# EAGLE design bottom PCB (EAGLE 7.2.0)
CNAME: SHF ROBOTICS; CREVISION: 2; DESIGNER: TOM HULBERT
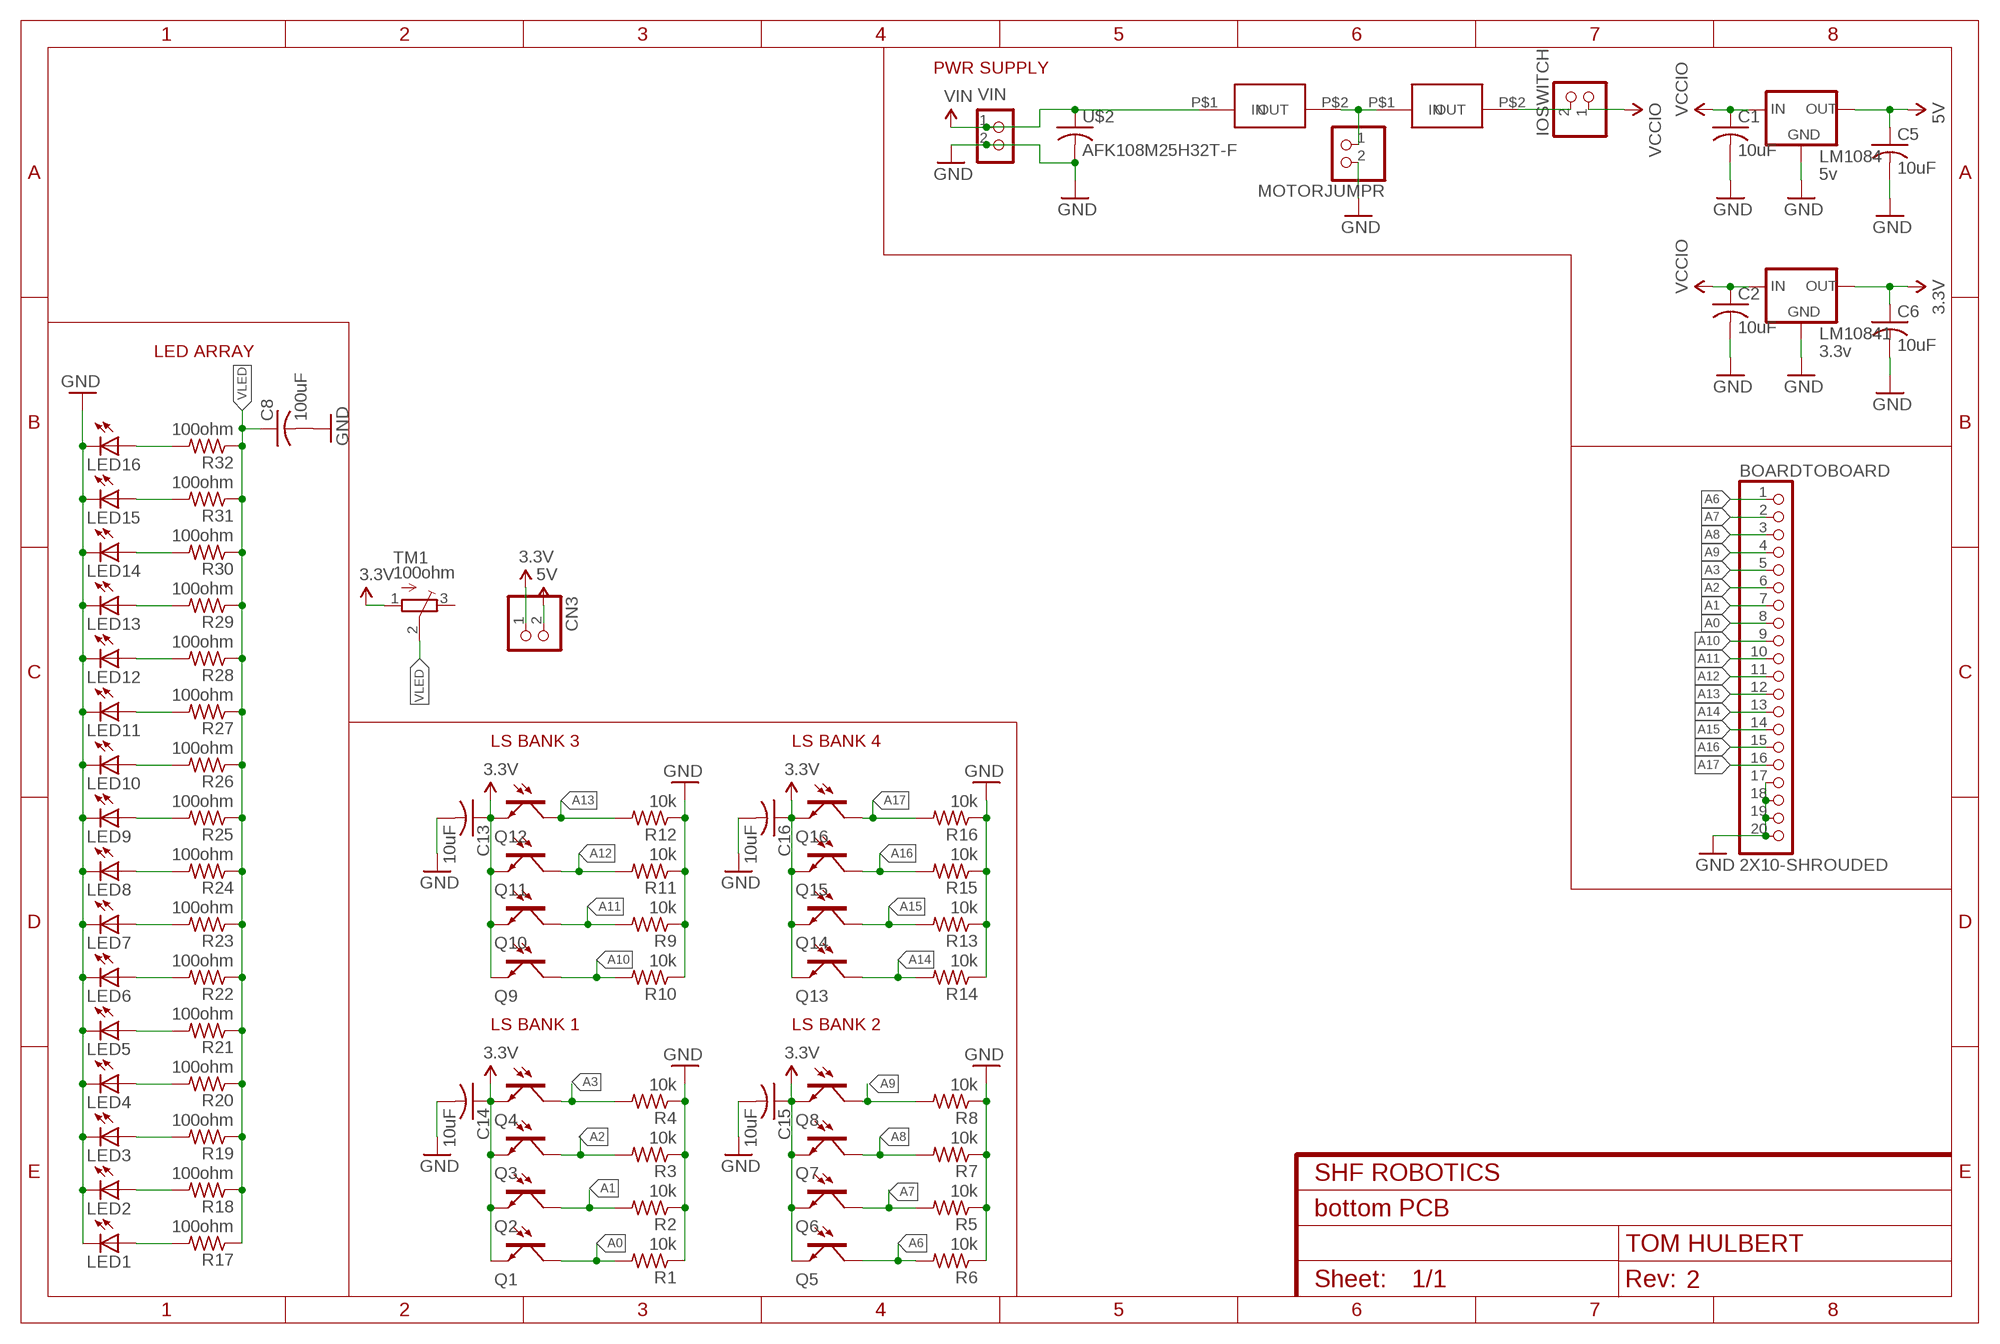
[diagram p0: schematic, sheet 1]

## Parts
2A  0153007_FUSE  [0153007_]
5A  5a  0153007_FUSE  [0153007_]
BOARDTOBOARD  2X10-SHROUDED  [2X10-SHROUDED]
C1  10uF  C-USC0805  [C0805]
C2  10uF  C-USC0805  [C0805]
C5  10uF  C-USC0805  [C0805]
C6  10uF  C-USC0805  [C0805]
C8  100uF  C-USC0805  [C0805]
C13  10uF  C-USC0805  [C0805]
C14  10uF  C-USC0805  [C0805]
C15  10uF  C-USC0805  [C0805]
C16  10uF  C-USC0805  [C0805]
CN3  JST_2PIN-SMT  [JST-PH-2-SMT]
IOSWITCH  JST_2PIN-SMT  [JST-PH-2-SMT]
LED1  LEDCHIPLED_0805  [CHIPLED_0805]
LED2  LEDCHIPLED_0805  [CHIPLED_0805]
LED3  LEDCHIPLED_0805  [CHIPLED_0805]
LED4  LEDCHIPLED_0805  [CHIPLED_0805]
LED5  LEDCHIPLED_0805  [CHIPLED_0805]
LED6  LEDCHIPLED_0805  [CHIPLED_0805]
LED7  LEDCHIPLED_0805  [CHIPLED_0805]
LED8  LEDCHIPLED_0805  [CHIPLED_0805]
LED9  LEDCHIPLED_0805  [CHIPLED_0805]
LED10  LEDCHIPLED_0805  [CHIPLED_0805]
LED11  LEDCHIPLED_0805  [CHIPLED_0805]
LED12  LEDCHIPLED_0805  [CHIPLED_0805]
LED13  LEDCHIPLED_0805  [CHIPLED_0805]
LED14  LEDCHIPLED_0805  [CHIPLED_0805]
LED15  LEDCHIPLED_0805  [CHIPLED_0805]
LED16  LEDCHIPLED_0805  [CHIPLED_0805]
LM1084  5v  LD29150  [D2PACK]
LM10841  3.3v  LD29150  [D2PACK]
MOTORJUMPR  JST_2PIN-SMT  [JST-PH-2-SMT]
Q1  PHOTOTRANSISTORCHIPLED_1206  [CHIPLED_1206]
Q2  PHOTOTRANSISTORCHIPLED_1206  [CHIPLED_1206]
Q3  PHOTOTRANSISTORCHIPLED_1206  [CHIPLED_1206]
Q4  PHOTOTRANSISTORCHIPLED_1206  [CHIPLED_1206]
Q5  PHOTOTRANSISTORCHIPLED_1206  [CHIPLED_1206]
Q6  PHOTOTRANSISTORCHIPLED_1206  [CHIPLED_1206]
Q7  PHOTOTRANSISTORCHIPLED_1206  [CHIPLED_1206]
Q8  PHOTOTRANSISTORCHIPLED_1206  [CHIPLED_1206]
Q9  PHOTOTRANSISTORCHIPLED_1206  [CHIPLED_1206]
Q10  PHOTOTRANSISTORCHIPLED_1206  [CHIPLED_1206]
Q11  PHOTOTRANSISTORCHIPLED_1206  [CHIPLED_1206]
Q12  PHOTOTRANSISTORCHIPLED_1206  [CHIPLED_1206]
Q13  PHOTOTRANSISTORCHIPLED_1206  [CHIPLED_1206]
Q14  PHOTOTRANSISTORCHIPLED_1206  [CHIPLED_1206]
Q15  PHOTOTRANSISTORCHIPLED_1206  [CHIPLED_1206]
Q16  PHOTOTRANSISTORCHIPLED_1206  [CHIPLED_1206]
R1  10k  R-US_M0805  [M0805]
R2  10k  R-US_M0805  [M0805]
R3  10k  R-US_M0805  [M0805]
R4  10k  R-US_M0805  [M0805]
R5  10k  R-US_M0805  [M0805]
R6  10k  R-US_M0805  [M0805]
R7  10k  R-US_M0805  [M0805]
R8  10k  R-US_M0805  [M0805]
R9  10k  R-US_M0805  [M0805]
R10  10k  R-US_M0805  [M0805]
R11  10k  R-US_M0805  [M0805]
R12  10k  R-US_M0805  [M0805]
R13  10k  R-US_M0805  [M0805]
R14  10k  R-US_M0805  [M0805]
R15  10k  R-US_M0805  [M0805]
R16  10k  R-US_M0805  [M0805]
R17  100ohm  R-US_M0805  [M0805]
R18  100ohm  R-US_M0805  [M0805]
R19  100ohm  R-US_M0805  [M0805]
R20  100ohm  R-US_M0805  [M0805]
R21  100ohm  R-US_M0805  [M0805]
R22  100ohm  R-US_M0805  [M0805]
R23  100ohm  R-US_M0805  [M0805]
R24  100ohm  R-US_M0805  [M0805]
R25  100ohm  R-US_M0805  [M0805]
R26  100ohm  R-US_M0805  [M0805]
R27  100ohm  R-US_M0805  [M0805]
R28  100ohm  R-US_M0805  [M0805]
R29  100ohm  R-US_M0805  [M0805]
R30  100ohm  R-US_M0805  [M0805]
R31  100ohm  R-US_M0805  [M0805]
R32  100ohm  R-US_M0805  [M0805]
TM1  100ohm  TRIMPOTTC33X  [TC33X]
U$2  AFK108M25H32T-F  [AFK108M25H32T-F]
VIN  CON_TERMINAL_BLOCK_02-5MM  [TERMINAL_BLOCK_2P_5]

## Nets
3.3V: C6.1 C13.1 C14.1 C15.1 C16.1 CN3.1 LM10841.2(VOUT) Q1.C Q2.C Q3.C Q4.C Q5.C Q6.C Q7.C Q8.C Q9.C Q10.C Q11.C Q12.C Q13.C Q14.C Q15.C Q16.C TM1.1(A)
5V: C5.1 CN3.2 LM1084.2(VOUT)
A0: BOARDTOBOARD.8 Q1.A R1.2
A1: BOARDTOBOARD.7 Q2.A R2.2
A2: BOARDTOBOARD.6 Q3.A R3.2
A3: BOARDTOBOARD.5 Q4.A R4.2
A6: BOARDTOBOARD.1 Q5.A R6.2
A7: BOARDTOBOARD.2 Q6.A R5.2
A8: BOARDTOBOARD.3 Q7.A R7.2
A9: BOARDTOBOARD.4 Q8.A R8.2
A10: BOARDTOBOARD.9 Q9.A R10.2
A11: BOARDTOBOARD.10 Q10.A R9.2
A12: BOARDTOBOARD.11 Q11.A R11.2
A13: BOARDTOBOARD.12 Q12.A R12.2
A14: BOARDTOBOARD.13 Q13.A R14.2
A15: BOARDTOBOARD.14 Q14.A R13.2
A16: BOARDTOBOARD.15 Q15.A R15.2
A17: BOARDTOBOARD.16 Q16.A R16.2
GND: BOARDTOBOARD.17 BOARDTOBOARD.18 BOARDTOBOARD.19 BOARDTOBOARD.20 C1.2 C2.2 C5.2 C6.2 C8.2 C13.2 C14.2 C15.2 C16.2 LED1.C LED2.C LED3.C LED4.C LED5.C LED6.C LED7.C LED8.C LED9.C LED10.C LED11.C LED12.C LED13.C LED14.C LED15.C LED16.C LM1084.1(GND) LM10841.1(GND) MOTORJUMPR.2 R1.1 R2.1 R3.1 R4.1 R5.1 R6.1 R7.1 R8.1 R9.1 R10.1 R11.1 R12.1 R13.1 R14.1 R15.1 R16.1 U$2.POS VIN.2
N$10: LED1.A R17.2
N$11: 2A.P$2(OUT) IOSWITCH.2
N$12: LED2.A R18.2
N$17: LED3.A R19.2
N$19: LED4.A R20.2
N$20: LED5.A R21.2
N$22: LED6.A R22.2
N$23: LED7.A R23.2
N$24: LED8.A R24.2
N$25: LED9.A R25.2
N$26: LED10.A R26.2
N$27: LED11.A R27.2
N$28: LED12.A R28.2
N$29: LED13.A R29.2
N$30: LED14.A R30.2
N$31: LED15.A R31.2
N$32: LED16.A R32.2
VCC: 2A.P$1(IN) 5A.P$2(OUT) MOTORJUMPR.1
VCCIO: C1.1 C2.1 IOSWITCH.1 LM1084.3(VIN) LM10841.3(VIN)
VIN: 5A.P$1(IN) U$2.NEG VIN.1
VLED: C8.1 R17.1 R18.1 R19.1 R20.1 R21.1 R22.1 R23.1 R24.1 R25.1 R26.1 R27.1 R28.1 R29.1 R30.1 R31.1 R32.1 TM1.2(S)
Unconnected: TM1.3(E)

## Notes on the sheet
- PWR SUPPLY
- LED ARRAY
- LS BANK 3 | LS BANK 4
- LS BANK 1 | LS BANK 2

## Library data of the parts
2A 5A = LittelFuse:0153007_
BOARDTOBOARD = 2x10 Shrouded Header:2X10-SHROUDED
C1 C2 C5 C6 C8 C13-C16 = adafruit:C-US: CAPACITOR, American symbol
CN3 IOSWITCH MOTORJUMPR = adafruit:JST_2PIN: JST 2-Pin Connectors of various flavors SMT-RA (S2B-PH-SM4) 4UConnector #17311 SMT (B2B-PH-SM4) THM-RA (S2B-PH) THM (B2B-PH)
LED1-LED16 = adafruit:LED: LED OSRAM: - CHIPLED LG R971, LG N971, LY N971, LG Q971, LY Q971, LO R971, LY R971 LH N974, LH R974 LS Q976, LO Q976, LY Q976 LO Q996 - Hyper CHIPLED LW Q18S LB Q993, LB Q99A, LB R99A - SideLED LS A670, LO A670, LY A670, LG A670, LP A670 LB A673, LV A673, LT A673, LW A673 LH A674 LY A675 LS A676, LA A676, LO A676, LY A676, LW A676 LS A679, LY A679, LG A679 - Hyper Micro SIDELED® LS Y876, LA Y876, LO Y876, LY Y876 LT Y87S - SmartLED LW L88C, LW L88S LB L89C, LB L89S, LG L890 LS L89K, LO L89K, LY L89K LS L896, LA L896, LO L896, LY L896 - TOPLED LS T670, LO T670, LY T670, LG T670, LP T670 LSG T670, LSP T670, LSY T670, LOP T670, LYG T670 LG T671, LOG T671, LSG T671 LB T673, LV T673, LT T673, LW T673 LH T674 LS T676, LA T676, LO T676, LY T676, LB T676, LH T676, LSB T676, LW T676 LB T67C, LV T67C, LT T67C, LS T67K, LO T67K, LY T67K, LW E67C LS E67B, LA E67B, LO E67B, LY E67B, LB E67C, LV E67C, LT E67C LW T67C LS T679, LY T679, LG T679 LS T770, LO T770, LY T770, LG T770, LP T770 LB T773, LV T773, LT T773, LW T773 LH T774 LS E675, LA E675, LY E675, LS T675 LS T776, LA T776, LO T776, LY T776, LB T776 LHGB T686 LT T68C, LB T68C - Hyper Mini TOPLED® LB M676 - Mini TOPLED Santana® LG M470 LS M47K, LO M47K, LY M47K Source: http://www.osram.convergy.de/
LM1084 LM10841 = bt_regulator:LD29150: STM LD29150 LDO Voltage Regulator The LD29150xx is a high current, high accuracy, low-dropout voltage regulator series. These regulators feature 400 mV dropout voltage and very low ground current. Designed for high current loads, these devices are also used in lower current, extremely low dropout-critical systems, where their tiny dropout voltage and ground current values are important attributes. Datasheet.pdf <http://www.st.com/web/en/resource/technical/document/datasheet/CD00003403.pdf>
Q1-Q16 = bt_opto:PHOTOTRANSISTOR: Phototransistor
R1-R32 = adafruit:R-US_: RESISTOR, American symbol
TM1 = adafruit:TRIMPOT: SMT trimmer potentiometer part number TC33X http://www.ladyada.net/library/eagle
U$2 = AFK108M25H32T-F Electrolytic Capacitor:AFK108M25H32T-F
VIN = dp_devices:CON_TERMINAL_BLOCK_02: 2 poles wire to board terminal block

## Module TEST
Ports: 

### Library data of the parts

## Module TSOP
Ports: 

### Library data of the parts

## Board
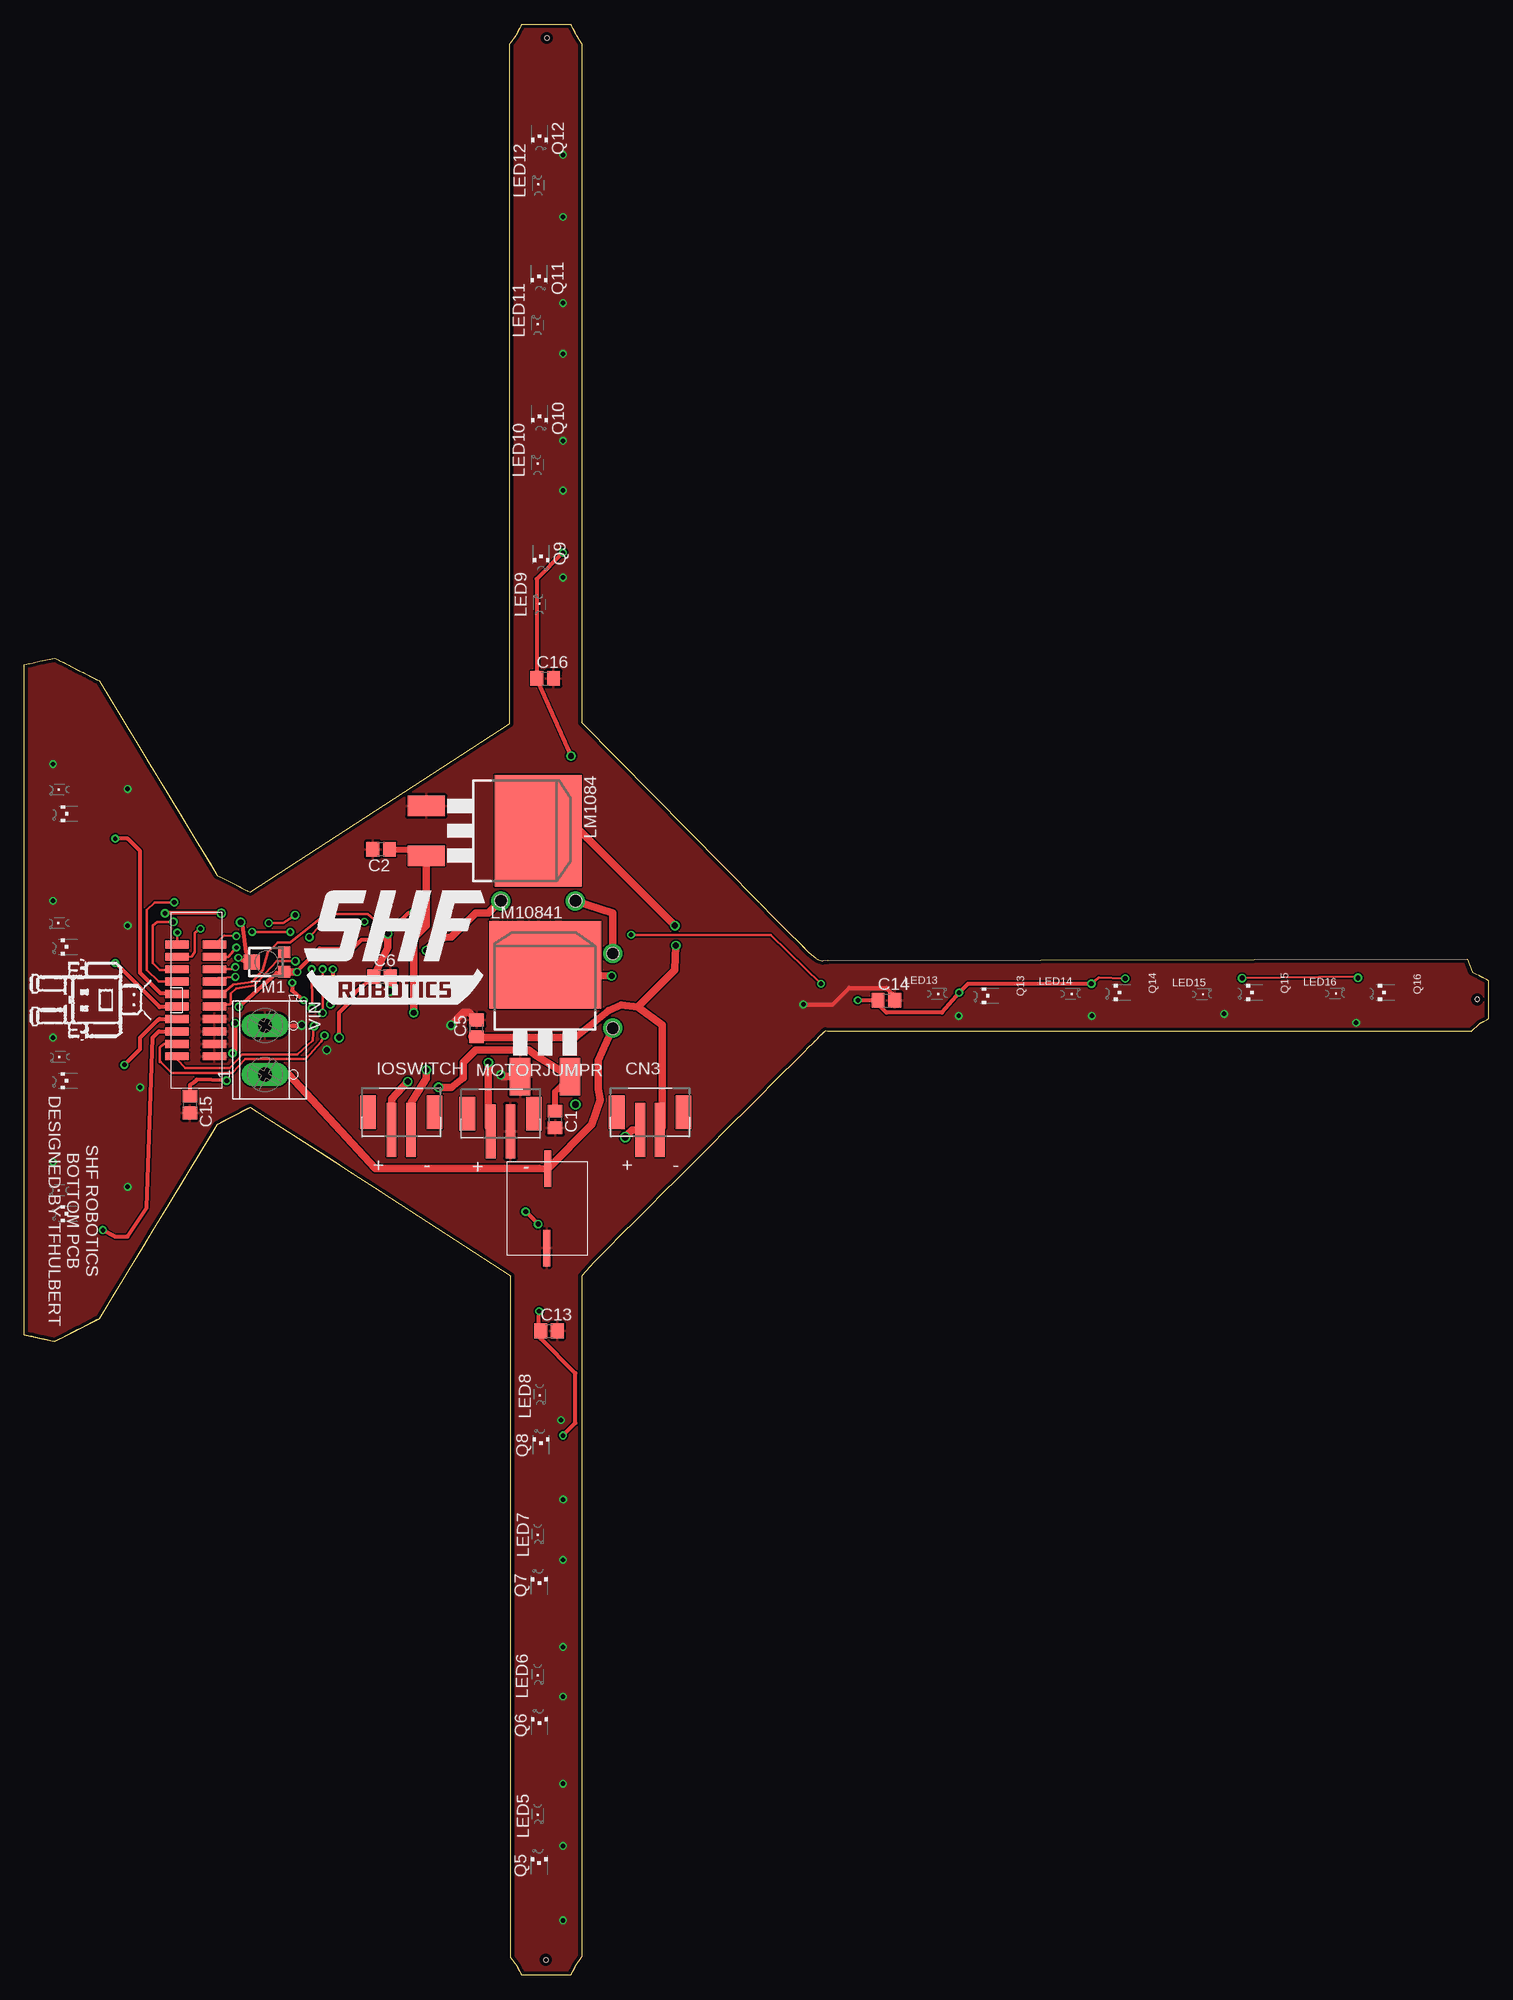
[diagram p1: board, top side]
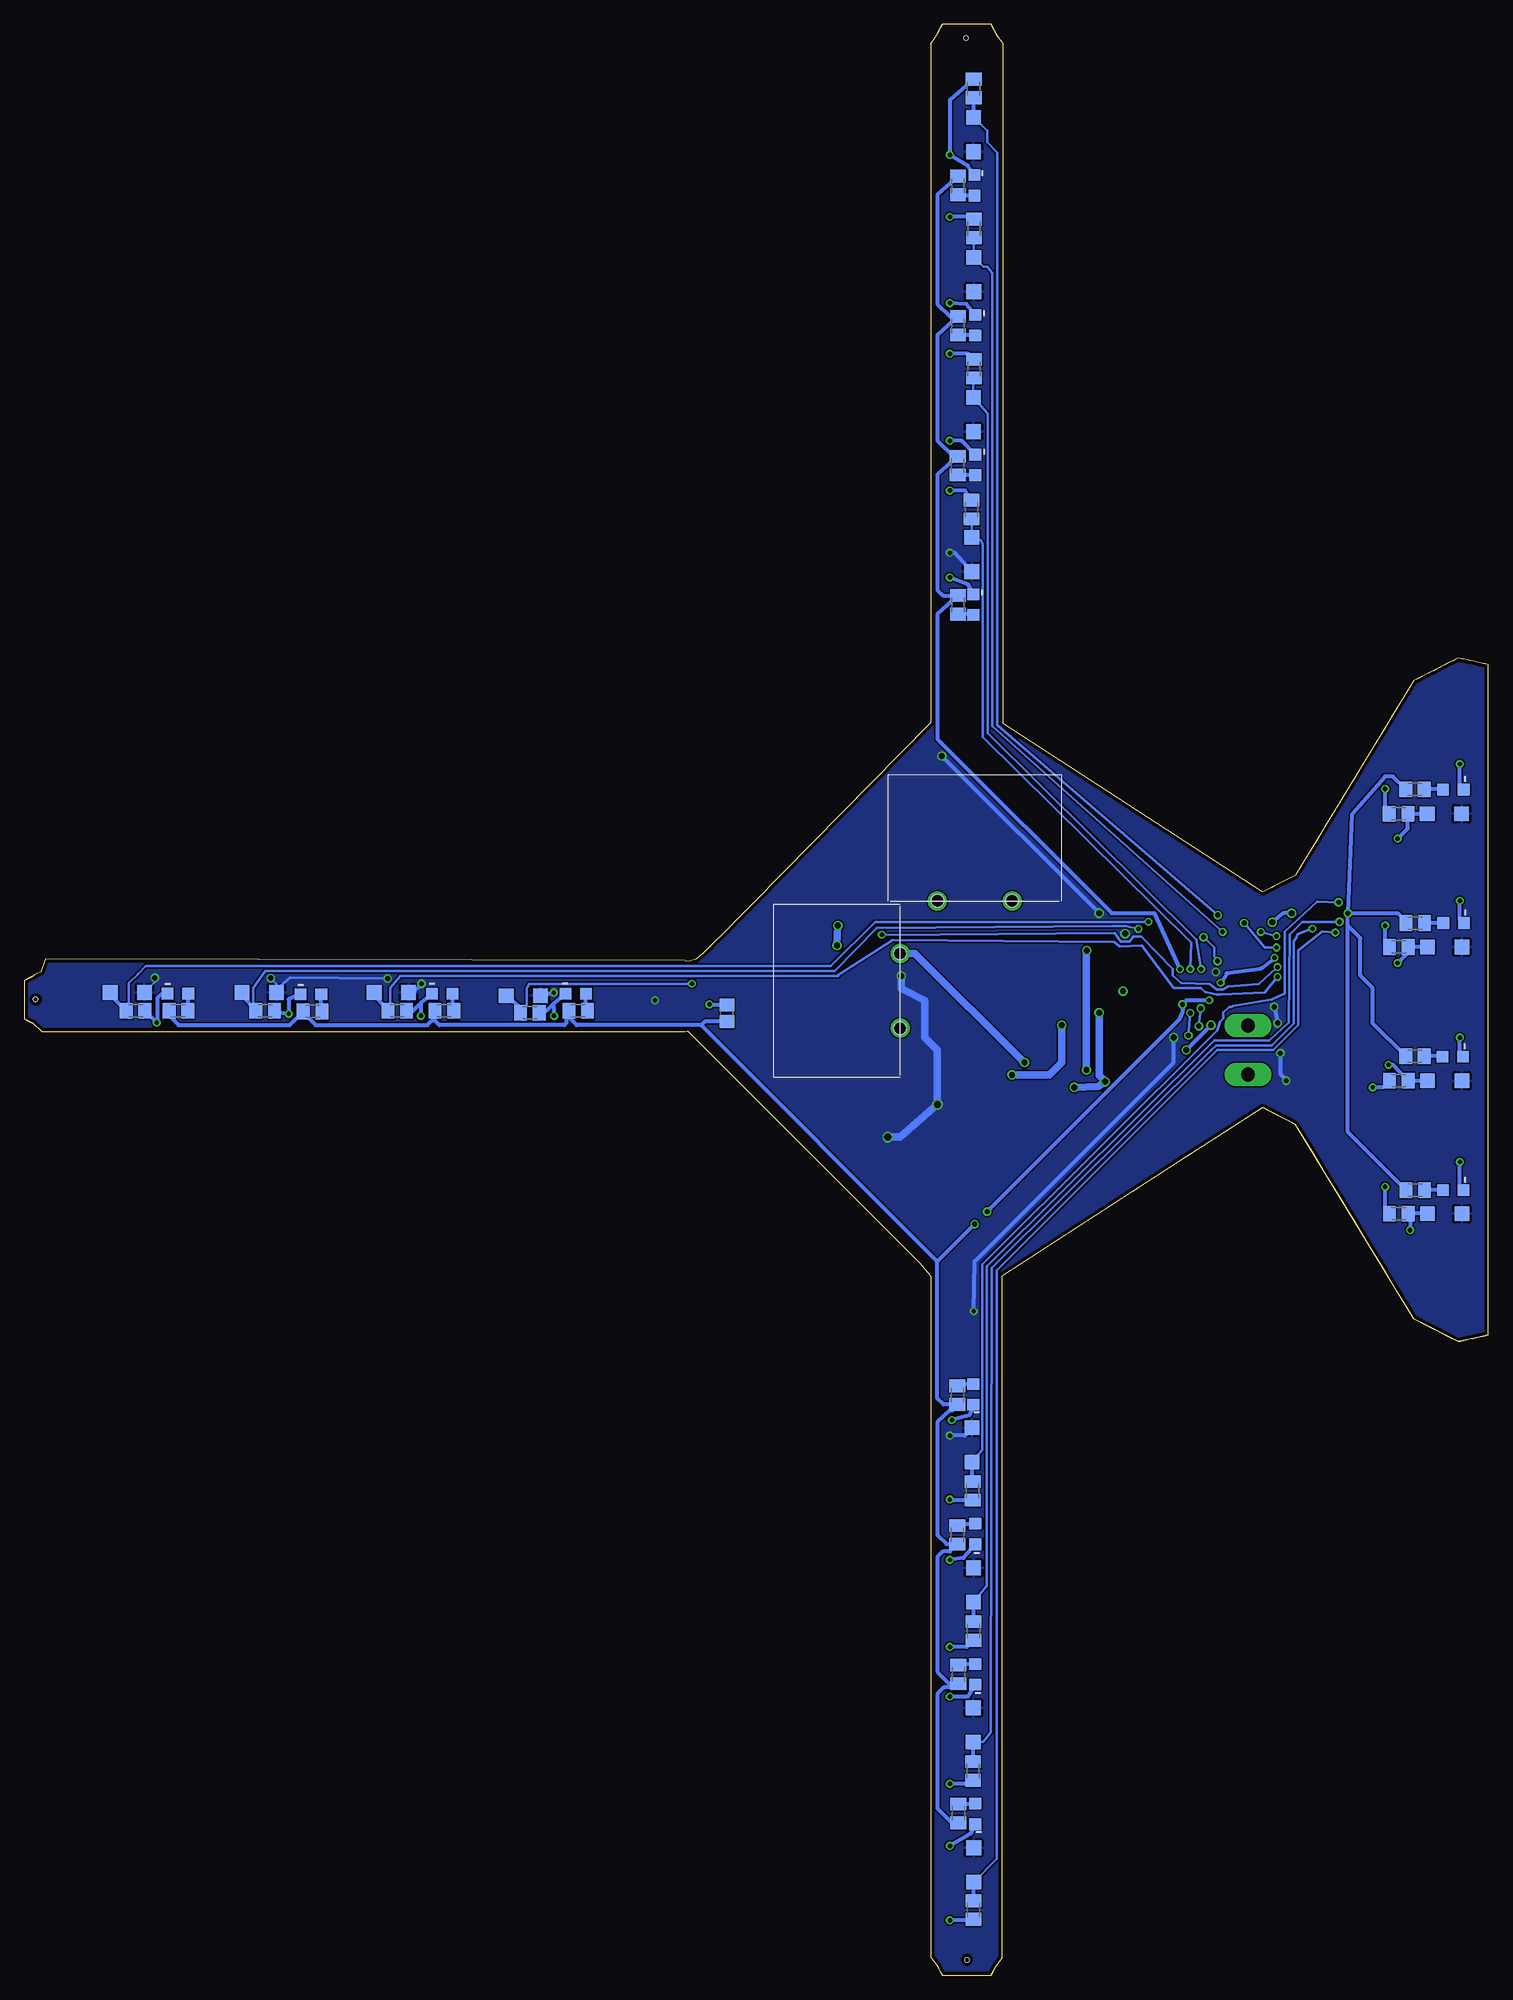
[diagram p2: board, bottom side, seen from below]

Size 149.48 x 199.22 mm. Coordinates in mm from the lower left corner, seen from the top.
Outline: 0,65.37 1.55,65.03
Outline: 1.55,65.03 3.09,64.7
Outline: 3.09,64.7 7.63,67.03
Outline: 7.63,67.03 19.71,86.89
Outline: 19.71,86.89 23.03,88.6
Outline: 23.03,88.6 36.43,79.99
Outline: 36.43,79.99 49.64,71.38 49.64,1.77 50.31,0.88
Outline: 50.31,0.88 50.78,0
Outline: 55.77,0 56.25,0.88
Outline: 56.25,0.88 56.92,1.87 56.92,71.38 58.13,72.8 59.54,74.21 60.95,75.62 62.36,77.03 63.77,78.44 65.19,79.85 66.6,81.26 68.01,82.68 69.42,84.09 72.24,86.91 73.65,88.32 75.07,89.73 76.48,91.15 79.3,93.97 79.47,94.14 80.15,94.82
Outline: 80.15,94.82 80.49,95.16
Outline: 80.49,95.16 80.83,95.5
Outline: 80.83,95.5 81.17,95.84
Outline: 81.17,95.84 81.75,96.42
Outline: 148.6,97.16 147.71,96.39 82.02,96.39 81.75,96.42
Outline: 148.6,97.16 149.48,97.63
Outline: 149.48,101.59 148.6,102.05
Outline: 79.3,105.24 80.15,104.39 80.83,103.81 81,103.74 81.17,103.67 81.34,103.6 81.51,103.59 82.03,103.63 147.34,103.78 147.82,102.46 147.93,102.4 148.15,102.29 148.26,102.23 148.49,102.11 148.6,102.05
Outline: 56.48,197.89 56.92,197.25 56.92,127.93 75.07,109.47 76.48,108.06 77.89,106.65 79.3,105.24
Outline: 56.48,197.89 56.25,198.34
Outline: 56.25,198.34 56.01,198.78
Outline: 56.01,198.78 55.77,199.22
Outline: 50.78,199.22 50.54,198.78
Outline: 50.54,198.78 50.31,198.34
Outline: 50.31,198.34 50.07,197.89
Outline: 50.07,197.89 49.54,197.25 49.54,127.83 23.03,110.62
Outline: 0,133.84 0.77,134.01
Outline: 0.77,134.01 1.55,134.18
Outline: 1.55,134.18 2.32,134.34
Outline: 2.32,134.34 3.09,134.51
Outline: 3.09,134.51 7.63,132.19
Outline: 7.63,132.19 19.71,112.32
Outline: 19.71,112.32 20.54,111.89
Outline: 20.54,111.89 21.37,111.47
Outline: 21.37,111.47 22.2,111.04
Outline: 22.2,111.04 23.03,110.62
Outline: 56.25,0.88 56.19,0.77 56.13,0.66 56.07,0.55 56.01,0.44 55.95,0.33 55.83,0.11 55.77,0
Outline: 55.77,0 50.78,0
Outline: 50.78,0 50.72,0.11 50.66,0.22 50.6,0.33 50.54,0.44 50.43,0.66 50.37,0.77 50.31,0.88
Outline: 36.43,79.99 34.76,81.07 33.08,82.15 31.41,83.22 29.73,84.3 28.06,85.37 26.38,86.45 24.7,87.53 23.03,88.6
Outline: 23.03,88.6 22.82,88.5 22.61,88.39 22.41,88.28 22.2,88.17 21.99,88.07 21.78,87.96 21.58,87.85 21.37,87.75 21.16,87.64 20.95,87.53 20.74,87.42 20.54,87.32 20.33,87.21 20.12,87.1 19.91,87 19.71,86.89
Outline: 19.71,86.89 18.95,85.65 18.2,84.41 17.44,83.17 16.69,81.93 15.93,80.68 15.18,79.44 14.42,78.2 13.67,76.96 12.91,75.72 12.16,74.48 11.4,73.24 10.65,72 9.89,70.76 9.14,69.52 8.39,68.28 7.63,67.03
Outline: 7.63,67.03 7.35,66.89 7.06,66.74 6.78,66.6 6.5,66.45 6.21,66.3 5.93,66.16 5.64,66.01 5.36,65.87 5.08,65.72 4.79,65.57 4.51,65.43 4.23,65.28 3.94,65.13 3.37,64.84 3.09,64.7
Outline: 3.09,64.7 2.9,64.74 2.7,64.78 2.51,64.82 2.12,64.91 1.93,64.95 1.55,65.03
Outline: 1.55,65.03 1.35,65.08 1.16,65.12 0.97,65.16 0.77,65.2 0.58,65.25 0.39,65.29 0.19,65.33 0,65.37
Outline: 0,65.37 0,133.84
Outline: 0,133.84 0.39,133.92 0.58,133.96 0.77,134.01
Outline: 0.77,134.01 0.97,134.05 1.16,134.09 1.35,134.13 1.55,134.18
Outline: 1.55,134.18 1.93,134.26 2.12,134.3 2.32,134.34
Outline: 2.32,134.34 2.51,134.39 2.7,134.43 3.09,134.51
Outline: 3.09,134.51 3.37,134.37 3.66,134.22 3.94,134.08 4.23,133.93 4.51,133.79 4.79,133.64 5.08,133.5 5.36,133.35 5.64,133.2 5.93,133.06 6.21,132.91 6.5,132.77 6.78,132.62 7.06,132.48 7.35,132.33 7.63,132.19
Outline: 7.63,132.19 8.39,130.94 9.89,128.46 10.65,127.22 11.4,125.98 12.91,123.49 13.67,122.25 14.42,121.01 15.18,119.77 15.93,118.53 16.69,117.29 17.44,116.05 18.2,114.8 18.95,113.56 19.71,112.32
Outline: 19.71,112.32 19.91,112.21 20.12,112.11 20.33,112 20.54,111.89
Outline: 20.54,111.89 20.74,111.79 20.95,111.68 21.16,111.58 21.37,111.47
Outline: 21.37,111.47 21.58,111.36 21.78,111.26 21.99,111.15 22.2,111.04
Outline: 22.2,111.04 22.41,110.94 22.61,110.83 22.82,110.72 23.03,110.62
Outline: 50.07,197.89 50.13,198.01 50.19,198.12 50.25,198.23 50.31,198.34
Outline: 50.31,198.34 50.37,198.45 50.43,198.56 50.48,198.67 50.54,198.78
Outline: 50.54,198.78 50.6,198.89 50.66,199 50.72,199.11 50.78,199.22
Outline: 50.78,199.22 55.77,199.22
Outline: 55.77,199.22 55.83,199.11 55.89,199 55.95,198.89 56.01,198.78
Outline: 56.01,198.78 56.07,198.67 56.13,198.56 56.19,198.45 56.25,198.34
Outline: 56.25,198.34 56.3,198.23 56.36,198.12 56.42,198.01 56.48,197.89
Outline: 79.3,105.24 79.47,105.07 79.64,104.9
Outline: 148.6,102.05 148.71,102 148.82,101.94 148.93,101.88 149.04,101.82 149.26,101.71 149.37,101.65 149.48,101.59
Outline: 149.48,101.59 149.48,97.63
Outline: 149.48,97.63 149.37,97.57 149.26,97.51 149.15,97.45 149.04,97.4 148.93,97.34 148.82,97.28 148.71,97.22 148.6,97.16
Outline: 81.75,96.42 81.58,96.25 81.34,96.01 81.17,95.84
Outline: 81.17,95.84 81,95.67 80.83,95.5
Outline: 80.83,95.5 80.66,95.33 80.49,95.16
Outline: 80.49,95.16 80.32,94.99 80.15,94.82
Copper layers (1*16): Top 0.0356mm / dielectric 1.5011mm / Bottom 0.0356mm
Design rules "default *": minimum track width 6mil, minimum drill 13mil, track to track 6mil, track to pad 6mil, pad to pad 6mil, via to via 6mil, smd to smd 6mil, copper to edge 15mil, drill to drill 6mil, minimum pad ring 7mil, minimum via ring 7mil, stop-mask expansion 3mil, vias tented up to drill 15mil, thermal gap 10mil
Holes 0.45 mm at 148.34,99.64 53.24,1.54 53.34,197.84

### Footprints (pad centres in the part's own frame; a part is rotated, then mirrored left to right if it is on the bottom)
0153007_ = drill 1.3: P$1 -3.81,0; P$2 3.81,0 | hole 1.27: -3.81,0; 3.81,0
2X10-SHROUDED = smd 0.8 x 2.4: 1 -5.715,-1.905; 2 -4.445,-1.905; 3 -3.175,-1.905; 4 -1.905,-1.905; 5 -0.635,-1.905; 6 0.635,-1.905; 7 1.905,-1.905; 8 3.175,-1.905; 9 4.445,-1.905; 10 5.715,-1.905; 11 -5.715,1.905; 12 -4.445,1.905; 13 -3.175,1.905; 14 -1.905,1.905; 15 -0.635,1.905; 16 0.635,1.905; 17 1.905,1.905; 18 3.175,1.905; 19 4.445,1.905; 20 5.715,1.905
C0805 = smd 1.3 x 1.5: 1 -0.85,0; 2 0.85,0
JST-PH-2-SMT = smd 1 x 5.5: 1 -1,-1.8; 2 1,-1.8 | smd 1.6 x 3.4: NC1 -3.4,0; NC2 3.4,0
CHIPLED_0805 = smd 1.2 x 1.2 bottom: A 0,-1.05; C 0,1.05
D2PACK = smd 2.083 x 3.81: 1 -2.54,-8.89; 3 2.54,-8.89 | smd 11.43 x 8.89: 2 0,2.54
CHIPLED_1206 = smd 1.5 x 1.5 bottom: A 0,-1.75; C 0,1.75
M0805 = smd 1.3 x 1.6: 1 -0.95,0; 2 0.95,0
TC33X = smd 1.2 x 1.2: 1 -1,-1.825; 3 1,-1.825 | smd 1.5 x 1.6: 2 0,1.5
AFK108M25H32T-F = smd 0.7 x 3.7: NEG 4.1,0.7; POS 4.2,8.8
TERMINAL_BLOCK_2P_5 = drill 1.4 pad 2.38 long: 1 2.5,-0.45; 2 -2.5,-0.45

### Placement (x,y rotation side)
2A  52.45,109.71 0 bottom
5A  60.07,100.52 90 bottom
BOARDTOBOARD  17.49,99.55 270 top
C1  54.17,87.39 270 top
C2  36.42,114.97 180 top
C5  46.16,96.69 90 top
C6  36.51,101.97 0 top
C8  77.75,98.23 90 bottom
C13  53.56,65.79 0 top
C14  88.01,99.55 0 top
C15  16.89,88.89 270 top
C16  53.16,132.43 0 top
CN3  63.88,88.12 0 top
IOSWITCH  38.48,88.12 0 top
LED1  3.59,80.15 90 top
LED2  3.65,93.78 90 top
LED3  3.55,107.45 90 top
LED4  3.58,121.08 90 top
LED5  52.41,16.45 180 top
LED6  52.41,30.71 180 top
LED7  52.41,45.04 180 top
LED8  52.61,59.3 180 top
LED9  52.59,139.97 0 top
LED10  52.39,154.24 0 top
LED11  52.39,168.51 0 top
LED12  52.47,182.79 0 top
LED13  93.19,100.21 270 top
LED14  106.82,100.21 270 top
LED15  120.24,100.17 270 top
LED16  133.82,100.24 270 top
LM1084  49.91,116.86 270 top
LM10841  53.16,100.64 0 top
MOTORJUMPR  48.62,87.97 0 top
Q1  4.46,77.76 90 top
Q2  4.46,91.33 90 top
Q3  4.46,105 90 top
Q4  4.49,118.6 90 top
Q5  52.56,11.24 0 top
Q6  52.6,25.54 0 top
Q7  52.57,39.84 0 top
Q8  52.74,54.14 0 top
Q9  52.76,145.08 180 top
Q10  52.59,159.38 180 top
Q11  52.55,173.68 180 top
Q12  52.58,187.98 180 top
Q13  98.53,100.02 90 top
Q14  112.01,100.35 90 top
Q15  125.51,100.35 90 top
Q16  138.98,100.35 90 top
R1  9.14,77.76 0 bottom
R2  9.14,91.33 0 bottom
R3  9.14,105 0 bottom
R4  9.17,118.6 0 bottom
R5  52.62,20.84 90 bottom
R6  52.58,6.64 90 bottom
R7  52.59,35.14 90 bottom
R8  52.66,49.44 90 bottom
R9  52.52,164.06 270 bottom
R10  52.77,149.68 270 bottom
R11  52.53,178.38 270 bottom
R12  52.56,192.68 270 bottom
R13  111.41,98.47 180 bottom
R14  97.88,98.27 180 bottom
R15  124.91,98.47 180 bottom
R16  138.14,98.47 180 bottom
R17  7.47,80.17 0 bottom
R18  7.5,93.84 0 bottom
R19  7.47,107.44 0 bottom
R20  7.5,121.11 0 bottom
R21  54.13,16.5 90 bottom
R22  54.13,30.7 90 bottom
R23  54.23,44.96 90 bottom
R24  54.23,59.22 90 bottom
R25  54.17,139.95 270 bottom
R26  54.19,154.16 270 bottom
R27  54.15,168.46 270 bottom
R28  54.15,182.77 270 bottom
R29  92.93,98.48 0 bottom
R30  106.61,98.5 0 bottom
R31  120.06,98.41 0 bottom
R32  133.76,98.5 0 bottom
TM1  24.71,103.46 90 top
U$2  57.53,83.04 180 top
VIN  25.01,94.47 270 top

### Tracks (layer width: path | path; a pad name or v marks a point on that pad's centre or on a via)
3.3V  (via drill 0.45, 0.45 pad 0.2, 0.5, 0.5 pad 0.5, 0.6, 0.7 pad 0.41)
  Top 0.254: v112.4,101.78 109.69,101.86 v108.94,101.24 | v124.34,101.82 136.05,101.96 v136.17,101.84
  Top 0.406: v54.99,55.1 56.26,56.37 56.26,61.45 52.71,65 C13.1 52.45,66.05 v52.55,67.8 | v32.13,95.74 32.13,98.28 33.11,99.26 33.96,100.53 C6.1 | v21.88,98.88 25.76,102.36 TM1.1 | 17.54,91.34 17.37,91.23 | 17.37,91.23 16.89,90.89 C15.1 | v85.1,99.55 C14.1 87.16,99.13 88.01,98.28 93.68,98.28 v95.44,100.34 96.34,101.24 v108.94,101.24 | v55.81,124.5 C16.1 52.31,142.59 v54.99,145.27 | v27.84,102.44 27.84,102.54 30.14,104.84 33.54,104.84 34.44,105.74 36.48,105.74 v37.1,106.36 39.18,108.44 v39.75,108.44 | v20.64,91.34 17.59,91.44 17.37,91.23 | v21.52,97.22 21.54,94.44 v21.24,94.14
  Top 0.75: C6.1 37.1,104.94 v37.1,106.36 | v61.34,85.58 62.08,86.32 CN3.1 | TM1.1 v27.84,102.44 | v59.96,102.03 52.98,102.09 LM10841.2
  Bottom 0.254: v112.4,101.78 122.32,101.89 123.76,100.63 Q15.C 123.76,101.19 v124.34,101.82 | v136.17,101.84 136.17,101.41 Q16.C
  Bottom 0.406: Q8.C 53.43,55.1 v54.99,55.1 | v52.55,67.8 52.45,72.88 32.13,93.2 v32.13,95.74 | Q9.C 54.5,145.27 v54.99,145.27 | Q13.C 96.56,100.14 v95.44,100.34 | v21.24,94.14 21.24,92.04 v20.64,91.34 | v21.88,98.88 v21.52,97.22 | Q14.C 109.83,100.35 v108.94,101.24 | v55.81,124.5 v39.75,108.44
  Bottom 0.75: v61.34,85.58 60.07,85.58 v56.26,88.91 56.26,94.47 57.53,95.74 57.53,99.55 59.96,100.76 v59.96,102.03
  pour Bottom: -19.94,218.93 -19.94,-4.59 151.51,-4.59 151.51,218.93
5V  (via drill 0.6)
  Top 0.75: 45.68,95.84 C5.1 46.26,95.74 56.26,95.74 59.67,98.49 60.94,99.06 62.61,98.85 | CN3.2 65.15,86.59 65.15,97.01 62.61,98.85 | LM1084.2 56.26,117.33 v66.42,107.17 | v66.52,105.15 66.42,102.66 62.61,98.85
  Bottom 0.75: v66.42,107.17 v66.52,105.15
A0  (via drill 0.45)
  Top 0.406: v8,76.09 9.27,75.42 10.54,75.42 12.48,78.36 13.08,95.74 13.71,96.38 BOARDTOBOARD.8
  Bottom 0.406: Q1.A R1.2 8,77.57 v8,76.09
A1  (via drill 0.45)
  Top 0.406: v10.2,92.96 11.81,94.57 11.81,95.74 13.63,97.56 13.7,97.56 13.78,97.65 BOARDTOBOARD.7
  Bottom 0.406: Q2.A R2.2 9.72,92.96 v10.2,92.96
A2  (via drill 0.45)
  Top 0.406: BOARDTOBOARD.6 15.53,98.86 13.8,98.86 9.3,103.36 v9.27,103.36
  Bottom 0.406: Q3.A R3.2 8.19,104.44 v9.27,103.36
A3  (via drill 0.45)
  Top 0.406: BOARDTOBOARD.5 15.51,100.26 13.9,100.26 11.81,102.35 11.81,114.79 10.54,116.06 v9.27,116.06
  Bottom 0.406: Q4.A R4.2 8.22,117.11 v9.27,116.06
A6  (via drill 0.45)
  Top 0.254: v15.62,106.47 15.58,105.87 BOARDTOBOARD.1
  Bottom 0.254: Q5.A 50.2,11.85 50.2,71.96 27.69,94.47 21.97,94.47 19.43,97.01 19.43,104.63 16.99,106.57 v15.62,106.47
  Bottom 0.406: R6.2 52.56,7.61 Q5.A
A7  (via drill 0.45)
  Top 0.254: BOARDTOBOARD.2 17.07,104.01 17.4,104.51 17.4,106.41 v17.97,106.87
  Bottom 0.254: Q6.A 51.57,23.79 50.8,24.76 50.7,72.19 28.32,94.47 28.29,94.47 27.8,94.96 22.1,94.96 19.9,97.16 19.9,105.63 19.63,105.9 19.46,106.3 v17.97,106.87
  Bottom 0.406: R5.2 52.6,21.81 Q6.A
A8  (via drill 0.5)
  Top 0.254: v15.2,107.56 13.57,107.56 13.08,107.17 13.08,103.36 13.1,103.36 13.8,102.66 15.52,102.66 BOARDTOBOARD.3
  Bottom 0.254: Q7.A 51.2,39.76 51.2,72.36 28,95.46 22.4,95.46 20.4,97.26 20.3,106.26 19,107.56 v15.2,107.56
  Bottom 0.406: R7.2 52.57,36.11 Q7.A
A9  (via drill 0.5)
  Top 0.254: v15.3,109.56 13.3,109.56 12.5,108.76 12.5,102.66 13.7,101.46 BOARDTOBOARD.4
  Bottom 0.254: Q8.A 51.7,53.63 51.7,72.56 27.7,96.46 27.4,97.36 27.05,97.71 27.05,98.28 26.47,98.86 26.2,98.86 26.1,98.96 22.12,99.64 20.8,100.26 20.8,106.56 17.5,109.66 v15.3,109.56
  Bottom 0.406: R8.2 52.64,50.41 Q8.A
A10  (via drill 0.45, 0.5)
  Top 0.254: BOARDTOBOARD.9 14.2,95.11 13.84,94.74 13.84,93.24 13.94,93.24 15.04,92.14 21.24,92.14 22.54,93.54 28.74,93.54 30.32,95.36 v30.63,95.95 | v30.44,102.74 v30.44,98.26
  Bottom 0.254: R10.2 52.74,148.83 Q9.A 52.27,146.54 51.84,146.54 51.64,146.14 51.64,126.44 30.34,105.44 v30.44,102.74 | v30.44,98.26 v30.63,95.95
A11  (via drill 0.45, 0.5)
  Top 0.254: BOARDTOBOARD.10 15.58,93.5 16.44,92.64 20.94,92.64 22.24,94.04 27.84,94.04 29.44,95.44 v29.56,96.91 | v29.34,102.74 v29.37,98.73
  Bottom 0.254: R9.2 52.59,163.04 Q10.A 51.14,159.48 51.14,126.84 29.84,105.74 v29.34,102.74 | v29.37,98.73 v29.56,96.91
A12  (via drill 0.45)
  Top 0.254: v27.14,106.54 v23.24,106.54 | v21.64,106.11 20.41,106.17 BOARDTOBOARD.11
  Bottom 0.254: R11.2 52.53,175.45 Q11.A 51.6,174.48 51.18,174.48 50.64,173.84 50.64,127.54 v27.14,106.54 | v23.24,106.54 v21.64,106.11
A13  (via drill 0.45, 0.5)
  Top 0.254: v21.64,104.94 20.78,104 BOARDTOBOARD.12 | v24.94,107.44 26.44,107.44 v27.64,108.24
  Bottom 0.254: 52.56,189.73 51.18,188.35 51.18,187.18 50.14,186.14 50.14,127.64 v27.64,108.24 | v21.64,104.94 22.84,104.94 v24.94,107.44
  Bottom 0.406: Q12.A 52.56,189.73 R12.2
A14  (via drill 0.45)
  Top 0.254: BOARDTOBOARD.13 21.22,102.73 v21.54,102.94 | v81.34,101.24 76.18,106.2 68.46,106.2 68.42,106.24 v61.94,106.24
  Bottom 0.254: 98.63,98.67 98.17,99.13 98.17,100.82 97.95,101.24 v81.34,101.24 | v21.54,102.94 21.64,102.84 23.44,101.24 26.54,100.94 27.14,100.64 27.74,100.64 28.44,101.24 31.38,101.34 32.23,102.09 32.23,102.73 35.44,106.04 36.24,106.04 36.64,105.54 37.54,105.54 38.14,106.44 v61.94,106.24
  Bottom 0.406: Q13.A 98.63,98.67 R14.2
A15  (via drill 0.45)
  Top 0.254: v21.54,101.94 19.78,101.84 BOARDTOBOARD.14
  Bottom 0.254: R13.2 112.14,98.49 112.14,100.82 111.12,102.04 66.37,102.04 66.37,102.14 60.81,105.7 38.2,105.5 37.64,105.04 35.38,105.14 32.13,100.82 29.39,100.82 28.89,100.42 27.72,100.12 27.34,100.14 22.84,100.34 v21.54,101.94
  Bottom 0.406: R13.2 113.76,100.07 Q14.A
A16  (via drill 0.45)
  Top 0.254: v35.74,106.84 35.94,107.64 35.04,108.34 30.74,108.34 27.14,105.44 25.84,105.44 24.84,104.44 24.34,102.64 23.24,101.44 21.34,101.14 20.14,100.14 19.44,100.14 BOARDTOBOARD.15
  Bottom 0.254: R15.2 126.11,98.92 126.11,100.82 124.89,102.54 66.74,102.54 62.44,106.94 38.34,107.14 37.04,107.14 v35.74,106.84
  Bottom 0.406: R15.2 127.26,100.07 Q15.A
A17  (via drill 0.45, 0.5)
  Top 0.254: v34.71,107.57 32.97,107.37 30.87,107.17 30.2,107.17 v29.09,106 | v27.66,103.55 25.74,103.54 23.44,101.04 21.64,100.74 21.04,100.24 21.04,99.24 20.94,99.14 19.62,99.14 BOARDTOBOARD.16
  Bottom 0.254: R16.2 138.81,98.75 138.81,101.32 137.89,102.24 | v34.71,107.57 62.61,107.57 67.14,103.04 137.09,103.04 137.89,102.24 | 137.94,102.24 137.89,102.24 | v29.09,106 27.99,104.96 28,104.95 28,104 27.54,103.54 v27.66,103.55
  Bottom 0.406: R16.2 140.73,100.11 Q16.A
GND  (via drill 0.45, 0.45 pad 0.25, 0.6)
  Top 0.406: v79.54,99.14 82.52,99.14 84.2,100.82 88.01,100.82 88.86,99.97 C14.2 | VIN.2 28.28,96.97 v28.32,97.01
  Top 0.75: C6.2 37.33,100.56 v37.31,100.49 | LM10841.1 48.82,91.75 v48.64,91.93 | v43.56,97.01 44.83,98.28 45.42,98.28 C5.2
  Bottom 0.406: LED7.C 53.6,42.6 v54.99,42.4 | R7.1 53.27,33.51 v54.99,33.51 | LED6.C 53.14,28.43 v54.99,28.43 | R5.1 52.97,19.54 v54.99,19.54 | LED5.C 52.85,14.46 v54.99,13.19 | R6.1 52.7,5.57 v54.99,5.57 | LED3.C 2.92,107.87 v2.92,109.71 | R3.1 10.54,105.45 v10.54,107.17 | LED2.C 2.92,94.1 v2.92,95.74 | R2.1 10.76,90.66 v11.81,90.66 | LED1.C 2.92,80.53 v2.92,83.04 | R1.1 10.54,78.21 v10.54,80.5 | LED4.C 2.92,121.47 v2.92,123.68 | R4.1 10.54,119.02 v10.54,121.14 | LED13.C 95.5,99.15 | 95.5,99.15 v95.4,97.96 | LED14.C 109,99.28 | 109,99.28 v109,97.96 | LED15.C 122.5,99.66 v122.5,98.16 122.55,98.16 R15.1 | LED8.C 52.99,57.17 v54.79,56.67 | R11.1 52.76,179.56 v54.99,179.56 | LED12.C 53.14,184.81 v54.99,185.91 54.99,191.5 R12.1 | LED11.C 53.3,170.67 v54.99,170.77 | R9.1 53.1,165.59 v54.99,165.59 | LED10.C 53.8,156.7 v54.99,156.7 | R10.1 53.43,151.62 v54.99,151.62 | LED9.C 53.1,142.03 v54.99,142.73 | R8.1 54.93,48.49 v55,48.56 | LED16.C 135.42,100.24 135.9,99.76 135.9,97.26 v135.98,97.26 R16.1 | 95.5,99.15 96.18,98.47 R14.1 | 109,99.28 109.81,98.47 R13.1 | C8.2 79.48,99.08 v79.54,99.14 | v28.32,97.01 v30.86,94.47
  Bottom 0.75: v48.64,91.93 44.83,91.93 43.56,93.2 v43.56,97.01
  pour Top: -14.86,216.39 152.78,216.39 152.78,-5.86 -14.86,-5.86
N$10
  Bottom 0.406: LED1.A 4.66,80.17 R17.2
N$11  (via drill 0.6)
  Top 0.75: 2A.P$2 47.37,108.44 46.1,108.44 43.56,106 42.29,105.9 v41.02,104.63 | IOSWITCH.2 39.48,89.12 41.02,91.56 41.02,92.44 v41.04,92.44
  Bottom 0.75: v41.02,104.63 41.04,104.63 v41.04,92.44
N$12
  Bottom 0.406: LED2.A 4.76,93.84 R18.2
N$17
  Bottom 0.406: LED3.A R19.2
N$19
  Bottom 0.406: LED4.A 4.66,121.11 R20.2
N$20
  Bottom 0.406: R21.2 54.08,17.5 LED5.A
N$22
  Bottom 0.406: R22.2 54.02,31.76 LED6.A
N$23
  Bottom 0.406: R23.2 54.05,46.09 LED7.A
N$24
  Bottom 0.406: R24.2 53.95,60.35 LED8.A
N$25
  Bottom 0.406: LED9.A 52.47,139 R25.2
N$26
  Bottom 0.406: LED10.A 54.17,153.19 R26.2
N$27
  Bottom 0.406: LED11.A 54.1,167.46 R27.2
N$28
  Bottom 0.406: LED12.A 54.07,181.74 R28.2
N$29
  Bottom 0.406: R29.2 92.24,98.48 LED13.A
N$30
  Bottom 0.406: R30.2 105.77,98.5 LED14.A
N$31
  Bottom 0.406: LED15.A 119.31,100.05 R31.2
N$32
  Bottom 0.406: LED16.A 132.81,100.2 R32.2
VCC  (via drill 0.6)
  Top 0.75: 2A.P$1 60.07,108.44 5A.P$2 | MOTORJUMPR.1 47.37,86.59 v47.37,93.2
  Bottom 0.75: 5A.P$2 58.6,104.33 v47.37,93.2
VCCIO  (via drill 0.6)
  Top 0.61: C2.1 39.21,114.97 40.46,113.73 40.46,113.76 LM1084.3 | C1.1 54.17,90.23 LM10841.3
  Top 0.75: v42.29,90.66 43.56,90.66 44.83,91.63 44.83,93.2 46.1,94.47 49.93,94.47 51.5,94.49 52.31,93.87 LM10841.3 | IOSWITCH.1 37.48,89.48 v39.14,91.24 | LM1084.3 41.02,107.17 39.75,105.9 v39.75,98.28
  Bottom 0.75: v42.29,90.66 39.82,90.76 v39.14,91.24 39.75,91.85 v39.75,98.28
VIN
  Top 0.75: VIN.1 27.01,91.97 35.8,82.36 52.59,82.36 U$2.NEG 57.94,86.85 58.8,89.39 58.61,90.47 58.61,93.39 5A.P$1
VLED  (via drill 0.45, 0.5, 0.6)
  Top 0.406: v20.09,108.44 v14.35,108.44 | v21.84,103.89 23.24,103.13 TM1.2 22.67,104.5 22.27,107.17 22.23,107.24 v22.07,107.53 | v31.49,102.73 31.49,100.47 v31.24,99.14 | v27.34,101.34 27.34,100.53 v28.52,99.55 | v52.45,76.69 v51.18,77.96
  Bottom 0.406: v14.35,108.44 9.27,108.44 8.42,107.59 R19.1 | R20.1 9.75,122.41 10.54,122.41 13.95,118.5 v14.35,108.44 | R18.1 11.81,97.2 11.81,100.82 13.08,102.09 13.08,105.9 14.35,107.17 v14.35,108.44 | R17.1 14.35,86.1 v14.35,108.44 | R21.1 54.81,15.55 56.26,17 56.26,28.7 55.6,29.36 54.52,29.36 R22.1 55.04,29.75 56.26,30.97 56.26,42.7 55.7,43.26 54.98,43.26 R23.1 55.33,44.01 56.26,44.94 56.26,56.47 54.99,57.64 54.76,57.64 R24.1 55.62,58.27 56.26,58.91 56.26,72.88 | v21.84,103.89 23.21,102.82 26.72,102.32 26.72,102.26 v27.34,101.34 | R28.1 56.26,181.81 56.26,170.67 55,169.41 R27.1 56.26,167.5 56.26,156.7 54.67,155.11 R26.1 56.26,153.24 56.26,141.46 55.7,140.9 R25.1 56.26,139.01 56.26,126.22 38.48,108.44 34.11,108.44 v31.49,102.73 | 56.26,72.88 80.39,97.01 | 80.39,97.01 93.09,97.01 94.18,98.1 | 94.18,98.1 R29.1 | 94.18,98.1 94.18,97.19 94.36,97.01 107.11,97.01 107.74,97.64 107.74,98.32 R30.1 107.56,97.78 108.33,97.01 119.76,97.01 121.01,98.26 R31.1 122.41,97.01 133.73,97.01 134.71,97.99 R32.1 | C8.1 80.02,97.38 80.39,97.01 | v28.52,99.55 30.83,99.55 v31.24,99.14 31.22,98.64 31.25,98.28 31.49,97.65 v51.18,77.96 | 56.26,72.88 v52.45,76.69 | v20.09,108.44 20.95,108.44 v22.07,107.53

### Text on the board
tPlace: SHF ROBOTICS / BOTTOM PCB / DESIGNED BY TFHULBERT
bNames: - | - | - | - | - | - | - | - | - | - | - | - | - | - | - | -
200bmp: C:/Users/Hulbert Office/Dropbox/SHF Robotics/stuff/robot.bmp